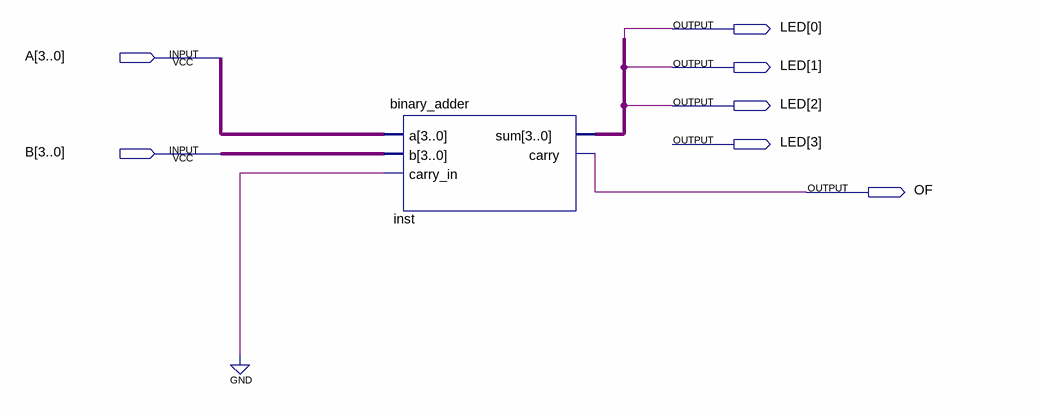
[diagram p0: schematic sheet]
// Quartus schematic test.bdf as structural Verilog: 1 symbols, 7 pins
module test (
  input  [3:0] A,
  input  [3:0] B,
  output [3:0] LED,
  output OF
);

  wire [3:0] inst_sum;

  binary_adder inst (.a(A), .b(B), .carry_in(1'b0), .sum(inst_sum), .carry(OF));
endmodule
